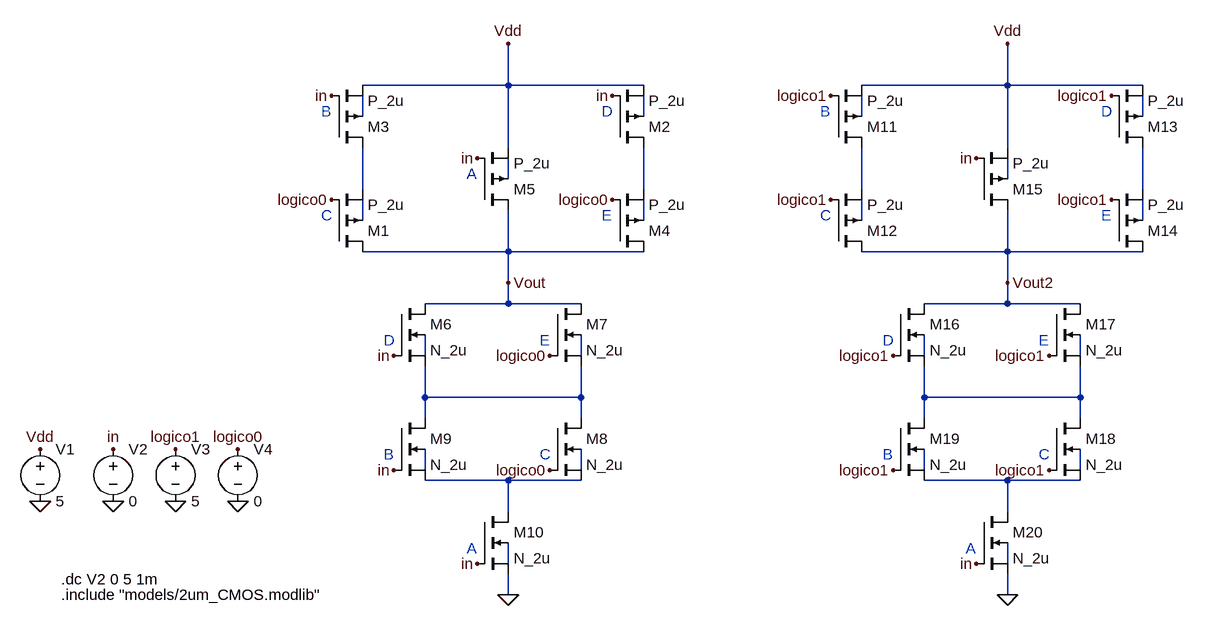
[diagram p0: schematic 2a.asc]
2a.asc, the LTspice schematic file:
Version 4
SHEET 1 2136 1008
WIRE 128 -32 128 -96
WIRE 128 -32 -96 -32
WIRE 336 -32 128 -32
WIRE 896 -32 896 -96
WIRE 896 -32 672 -32
WIRE 1104 -32 896 -32
WIRE -96 16 -96 -16
WIRE 336 16 336 -16
WIRE 672 16 672 -16
WIRE 1104 16 1104 -16
WIRE 128 64 128 -32
WIRE 896 64 896 -32
WIRE 128 112 128 80
WIRE 896 112 896 80
WIRE -96 128 -96 64
WIRE 336 128 336 64
WIRE 672 128 672 64
WIRE 1104 128 1104 64
WIRE -96 176 -96 144
WIRE 336 176 336 144
WIRE 672 176 672 144
WIRE 1104 176 1104 144
WIRE 128 224 128 160
WIRE 128 224 -96 224
WIRE 336 224 128 224
WIRE 896 224 896 160
WIRE 896 224 672 224
WIRE 1104 224 896 224
WIRE 128 272 128 224
WIRE 896 272 896 224
WIRE 128 304 128 272
WIRE 128 304 0 304
WIRE 240 304 128 304
WIRE 896 304 896 272
WIRE 896 304 768 304
WIRE 1008 304 896 304
WIRE 0 384 0 352
WIRE 240 384 240 352
WIRE 768 384 768 352
WIRE 1008 384 1008 352
WIRE 0 448 0 400
WIRE 240 448 240 400
WIRE 240 448 0 448
WIRE 768 448 768 400
WIRE 1008 448 1008 400
WIRE 1008 448 768 448
WIRE 0 480 0 448
WIRE 240 480 240 448
WIRE 768 480 768 448
WIRE 1008 480 1008 448
WIRE 0 560 0 528
WIRE 240 560 240 528
WIRE 768 560 768 528
WIRE 1008 560 1008 528
WIRE 128 576 0 576
WIRE 240 576 128 576
WIRE 896 576 768 576
WIRE 1008 576 896 576
WIRE 128 624 128 576
WIRE 896 624 896 576
WIRE 128 704 128 672
WIRE 896 704 896 672
WIRE 128 752 128 720
WIRE 896 752 896 720
FLAG 128 -96 Vdd
FLAG 128 752 0
FLAG -592 608 0
FLAG -480 608 0
FLAG -384 608 0
FLAG -288 608 0
FLAG -592 528 Vdd
FLAG -480 528 in
FLAG -384 528 logico1
FLAG -288 528 logico0
FLAG 128 272 Vout
FLAG 896 -96 Vdd
FLAG 896 752 0
FLAG 896 272 Vout2
FLAG 80 80 in
FLAG 80 704 in
FLAG 848 704 in
FLAG 960 384 logico1
FLAG 960 560 logico1
FLAG 848 80 in
FLAG 624 144 logico1
FLAG 1056 144 logico1
FLAG 288 144 logico0
FLAG -144 -16 in
FLAG 288 -16 in
FLAG 192 384 logico0
FLAG -48 384 in
FLAG -48 560 in
FLAG -144 144 logico0
FLAG 192 560 logico0
FLAG 720 560 logico1
FLAG 720 384 logico1
FLAG 1056 -16 logico1
FLAG 624 -16 logico1
SYMBOL voltage -592 512 R0
WINDOW 123 0 0 Left 0
WINDOW 39 0 0 Left 0
SYMATTR InstName V1
SYMATTR Value 5
SYMBOL voltage -480 512 R0
WINDOW 123 0 0 Left 0
WINDOW 39 0 0 Left 0
SYMATTR InstName V2
SYMATTR Value 0
SYMBOL voltage -384 512 R0
WINDOW 123 0 0 Left 0
WINDOW 39 0 0 Left 0
SYMATTR InstName V3
SYMATTR Value 5
SYMBOL voltage -288 512 R0
WINDOW 123 0 0 Left 0
WINDOW 39 0 0 Left 0
SYMATTR InstName V4
SYMATTR Value 0
SYMBOL pmos4 -144 64 M180
SYMATTR InstName M3
SYMATTR Value P_2u
SYMATTR Value2 l=2u w=12u
SYMBOL pmos4 -144 224 M180
SYMATTR InstName M1
SYMATTR Value P_2u
SYMATTR Value2 l=2u w=12u
SYMBOL pmos4 288 64 M180
SYMATTR InstName M2
SYMATTR Value P_2u
SYMATTR Value2 l=2u w=12u
SYMBOL pmos4 288 224 M180
SYMATTR InstName M4
SYMATTR Value P_2u
SYMATTR Value2 l=2u w=12u
SYMBOL pmos4 80 160 M180
SYMATTR InstName M5
SYMATTR Value P_2u
SYMATTR Value2 l=2u w=6u
SYMBOL nmos4 -48 304 R0
SYMATTR InstName M6
SYMATTR Value N_2u
SYMATTR Value2 l=2u w=12u
SYMBOL nmos4 192 304 R0
SYMATTR InstName M7
SYMATTR Value N_2u
SYMATTR Value2 l=2u w=12u
SYMBOL nmos4 192 480 R0
SYMATTR InstName M8
SYMATTR Value N_2u
SYMATTR Value2 l=2u w=12u
SYMBOL nmos4 -48 480 R0
SYMATTR InstName M9
SYMATTR Value N_2u
SYMATTR Value2 l=2u w=12u
SYMBOL nmos4 80 624 R0
SYMATTR InstName M10
SYMATTR Value N_2u
SYMATTR Value2 l=2u w=12u
SYMBOL pmos4 624 64 M180
SYMATTR InstName M11
SYMATTR Value P_2u
SYMATTR Value2 l=2u w=12u
SYMBOL pmos4 624 224 M180
SYMATTR InstName M12
SYMATTR Value P_2u
SYMATTR Value2 l=2u w=12u
SYMBOL pmos4 1056 64 M180
SYMATTR InstName M13
SYMATTR Value P_2u
SYMATTR Value2 l=2u w=12u
SYMBOL pmos4 1056 224 M180
SYMATTR InstName M14
SYMATTR Value P_2u
SYMATTR Value2 l=2u w=12u
SYMBOL pmos4 848 160 M180
SYMATTR InstName M15
SYMATTR Value P_2u
SYMATTR Value2 l=2u w=6u
SYMBOL nmos4 720 304 R0
SYMATTR InstName M16
SYMATTR Value N_2u
SYMATTR Value2 l=2u w=12u
SYMBOL nmos4 960 304 R0
SYMATTR InstName M17
SYMATTR Value N_2u
SYMATTR Value2 l=2u w=12u
SYMBOL nmos4 960 480 R0
SYMATTR InstName M18
SYMATTR Value N_2u
SYMATTR Value2 l=2u w=12u
SYMBOL nmos4 720 480 R0
SYMATTR InstName M19
SYMATTR Value N_2u
SYMATTR Value2 l=2u w=12u
SYMBOL nmos4 848 624 R0
SYMATTR InstName M20
SYMATTR Value N_2u
SYMATTR Value2 l=2u w=12u
TEXT -560 728 Left 2 !.dc V2 0 5 1m
TEXT -560 752 Left 2 !.include "models/2um_CMOS.modlib"
TEXT 64 104 Left 2 ;A
TEXT 272 8 Left 2 ;D
TEXT 272 168 Left 2 ;E
TEXT -160 168 Left 2 ;C
TEXT -160 8 Left 2 ;B
TEXT 64 680 Left 2 ;A
TEXT 832 680 Left 2 ;A
TEXT 608 8 Left 2 ;B
TEXT 1040 8 Left 2 ;D
TEXT 1040 168 Left 2 ;E
TEXT 608 168 Left 2 ;C
TEXT -64 536 Left 2 ;B
TEXT -64 360 Left 2 ;D
TEXT 176 536 Left 2 ;C
TEXT 176 360 Left 2 ;E
TEXT 704 360 Left 2 ;D
TEXT 944 360 Left 2 ;E
TEXT 704 536 Left 2 ;B
TEXT 944 536 Left 2 ;C

The netlist it stands for:
* 2a.asc
V1 Vdd 0 5
V2 in 0 0
V3 logico1 0 5
V4 logico0 0 0
M3 N007 in Vdd N001 P_2u l=2u w=12u
M1 Vout logico0 N007 N011 P_2u l=2u w=12u
M2 N008 in Vdd N002 P_2u l=2u w=12u
M4 Vout logico0 N008 N012 P_2u l=2u w=12u
M5 Vout in Vdd N005 P_2u l=2u w=6u
M6 Vout in N019 N015 N_2u l=2u w=12u
M7 Vout logico0 N019 N016 N_2u l=2u w=12u
M8 N019 logico0 N025 N022 N_2u l=2u w=12u
M9 N019 in N025 N021 N_2u l=2u w=12u
M10 N025 in 0 N027 N_2u l=2u w=12u
M11 N009 logico1 Vdd N003 P_2u l=2u w=12u
M12 Vout2 logico1 N009 N013 P_2u l=2u w=12u
M13 N010 logico1 Vdd N004 P_2u l=2u w=12u
M14 Vout2 logico1 N010 N014 P_2u l=2u w=12u
M15 Vout2 in Vdd N006 P_2u l=2u w=6u
M16 Vout2 logico1 N020 N017 N_2u l=2u w=12u
M17 Vout2 logico1 N020 N018 N_2u l=2u w=12u
M18 N020 logico1 N026 N024 N_2u l=2u w=12u
M19 N020 logico1 N026 N023 N_2u l=2u w=12u
M20 N026 in 0 N028 N_2u l=2u w=12u
.model NMOS NMOS
.model PMOS PMOS
.lib standard.mos
.dc V2 0 5 1m
.include "models/2um_CMOS.modlib"
* A
* D
* E
* C
* B
* A
* A
* B
* D
* E
* C
* B
* D
* C
* E
* D
* E
* B
* C
.backanno
.end